# EAGLE design Adafruit Reversible USB Type A Plug Connector Breakout (EAGLE 9.6.2)
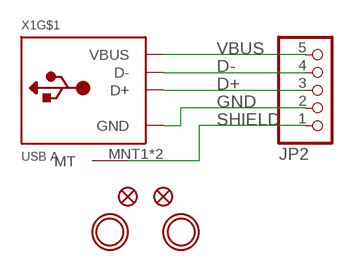
[diagram p0: schematic, sheet 1]

## Parts
FID1  FIDUCIAL_0.5MM  [FIDUCIAL_0.5MM]
FID2  FIDUCIAL_0.5MM  [FIDUCIAL_0.5MM]
JP2  HEADER-1X570MIL  [1X05_ROUND_70]
U$1  MOUNTINGHOLE2.5  [MOUNTINGHOLE_2.5_PLATED]
U$2  MOUNTINGHOLE2.5  [MOUNTINGHOLE_2.5_PLATED]
X1  USB A  USB_TYPEA_UG08WS  [USB_A-UG08WSW01]

## Nets
D+: JP2.3 X1.D+
D-: JP2.4 X1.D-
GND: JP2.2 X1.GND
SHIELD: JP2.1 X1.MNT1(MT) X1.MNT2(MT)
VBUS: JP2.5 X1.VBUS

## Library data of the parts
FID1 FID2 = microbuilder:FIDUCIAL: Fiducial Alignment Points Various fiducial points for machine vision alignment.
JP2 = microbuilder:HEADER-1X5: PIN HEADER
U$1 U$2 = adafruit_electromech:MOUNTINGHOLE: Mounting Hole For #2 screws (0.086"/2.18mm width, 0.094"/2.4mm hole) use 2.5mm; BOM: EXCLUDE
X1 = adafruit_electromech:USB_TYPEA: USB - Type A Connectors Male types stick out and are inserted into a PC or matching females parts (these are the connectors used on USB Memory Sticks, etc.). Female parts are generally used for USB Host and accept a male-type connector. SMT - 4UCON: 10017 PTHFML - Digikey: 609-1045-ND, 4UCon: 05241 PCB - Use 2.0mm thick PCBs with this footprint

## Board
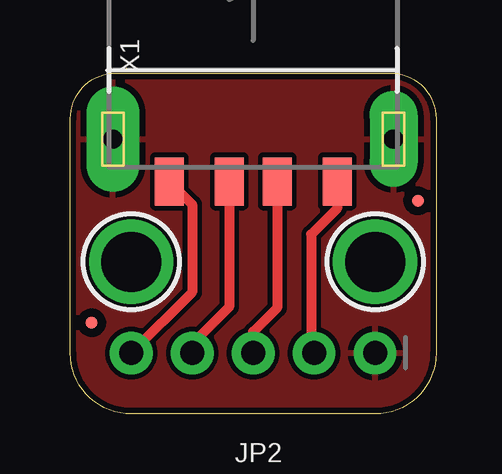
[diagram p1: board, top side]
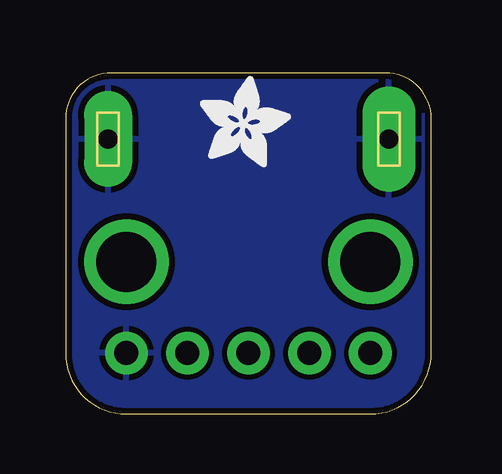
[diagram p2: board, bottom side, seen from below]

Size 15.24 x 14.22 mm. Coordinates in mm from the lower left corner, seen from the top.
Outline: 0,2.54 0,12.32 arc-90 1.91,14.22 13.34,14.22 arc-90 15.24,12.32 15.24,2.54 arc-90 12.7,0 2.54,0 arc-90 0,2.54
Copper layers (1*16): Top 0.035mm / dielectric 1.5mm / Bottom 0.035mm
Design rules "default": minimum track width 10mil, minimum drill 16mil, track to track 8mil, track to pad 8mil, pad to pad 8mil, via to via 8mil, smd to smd 8mil, copper to edge 10mil, drill to drill 8mil, minimum pad ring 10mil, minimum via ring 8mil, stop-mask expansion 4mil, vias tented up to drill 20mil, thermal gap 10mil

### Footprints (pad centres in the part's own frame; a part is rotated, then mirrored left to right if it is on the bottom)
FIDUCIAL_0.5MM = smd 0.5 x 0.5: 1 0,0
1X05_ROUND_70 = drill 1 pad 1.778: 1 -5.08,0; 2 -2.54,0; 3 0,0; 4 2.54,0; 5 5.08,0
MOUNTINGHOLE_2.5_PLATED = drill 2.5 pad 3.2: P$1 0,0
USB_A-UG08WSW01 = smd 1.2 x 2: D+ -1,0.97; D- 1,0.97; GND -3.5,0.97; VBUS 3.5,0.97 | drill 0.8 pad 2.2 long: MNT1 5.85,-0.8 | drill 0.8 pad 2 long: MNT2 -5.85,-0.8

### Placement (x,y rotation side)
FID1  0.89,3.81 0 top
FID2  14.48,8.89 0 top
JP2  7.62,2.54 180 top
PLABEL0  [PLABEL0]  5.21,4.06 0 top
PLABEL1  [PLABEL1]  7.75,1.02 0 top
PLABEL2  [PLABEL2]  10.03,4.06 0 top
PLABEL3  [PLABEL3]  12.45,0.89 0 top
PLABEL4  [PLABEL4]  2.54,1.02 0 top
PLABEL5  [PLABEL5]  7.62,6.86 0 top
PLABEL6  [PLABEL6]  7.62,6.86 0 bottom
U$1  2.54,6.35 0 top
U$2  12.7,6.35 0 top
U$4  [ADAFRUIT_3.5MM]  9.65,10.29 0 bottom
X1  7.62,10.67 180 top

### Tracks (layer width: path | path; a pad name or v marks a point on that pad's centre or on a via)
D+
  Top 0.406: X1.D+ 8.62,4.43 7.62,3.43 JP2.3
D-
  Top 0.406: X1.D- 6.62,4.46 5.08,2.92 JP2.4
GND
  Top 0.406: X1.GND 11.12,8.58 10.03,7.49 10.03,2.67 JP2.2
SHIELD
  pour Top: 0,15.24 15.24,15.24 15.24,0 0,0
  pour Bottom: 0,15.24 15.24,15.24 15.24,0 0,0
VBUS
  Top 0.406: X1.VBUS 5.08,8.74 5.08,5.08 JP2.5

### Text on the board
Pinguin_tBackup: Rev'ble / USB A | D- | GND | 5V | D+ | SHD
Pinguin_bBackup: Flippable / USB A / Plug